# Altium schematic sheet Power.SchDoc
size 420 x 297 mm; SheetNumber: 5; SheetTotal: 34
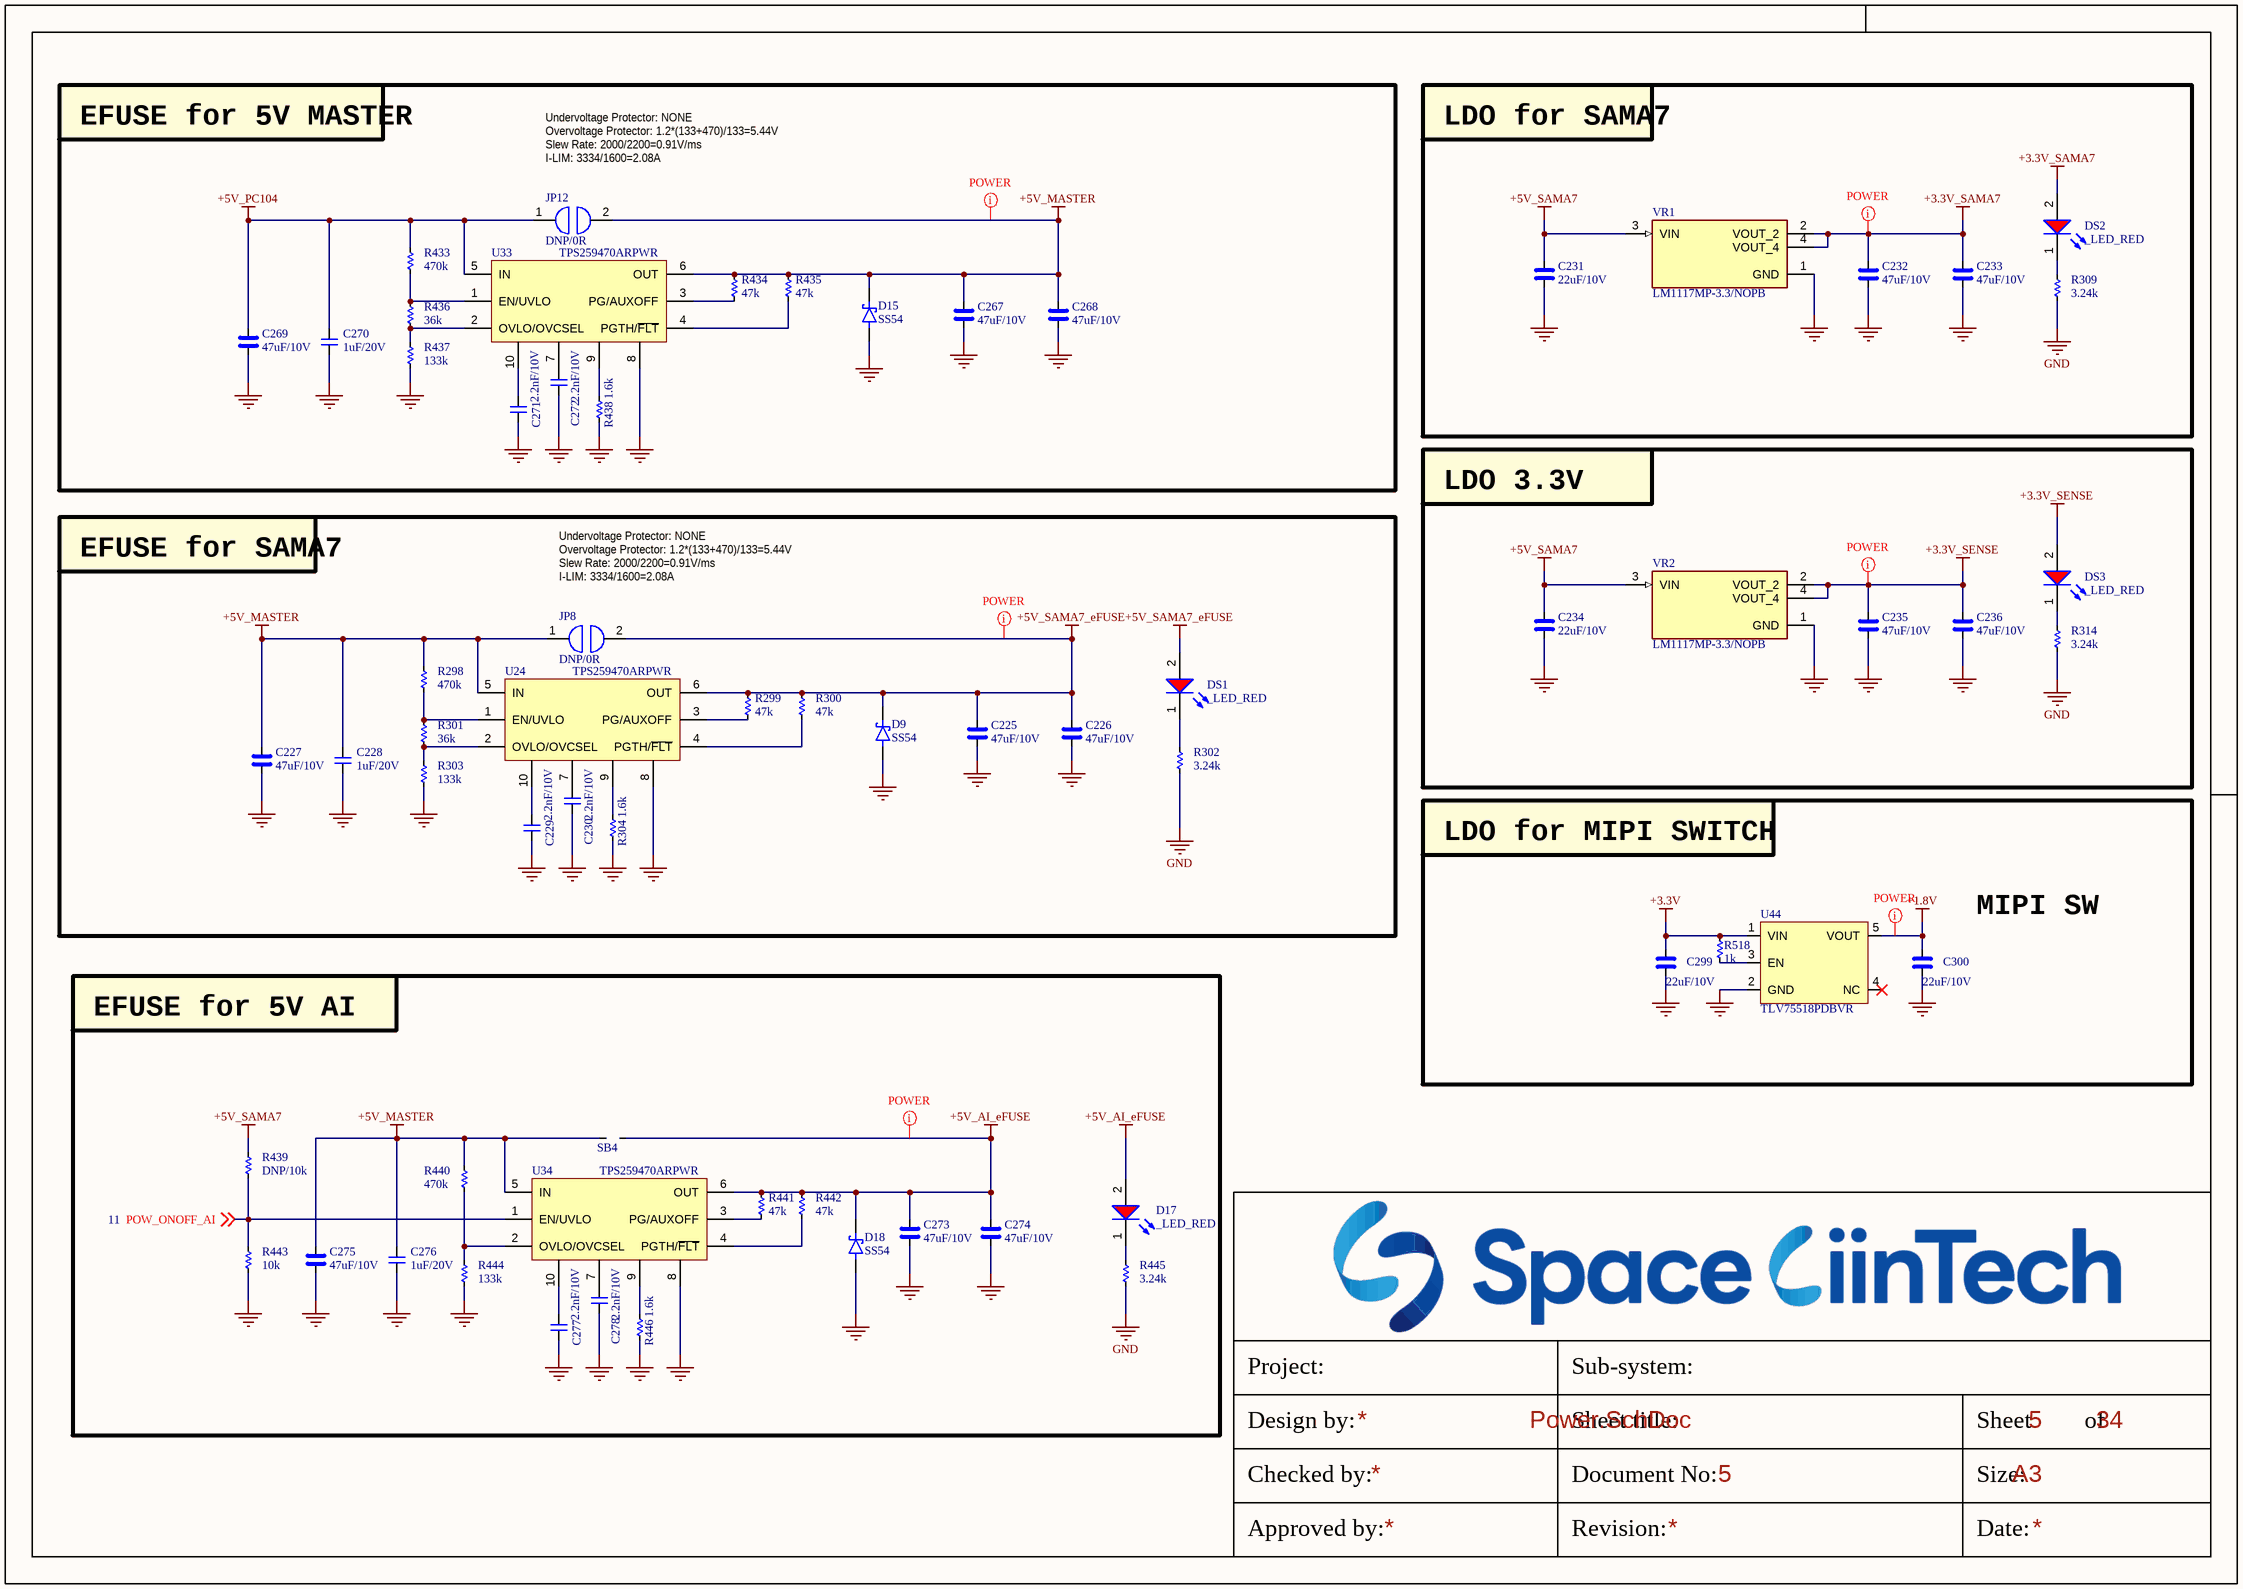
[diagram p0: Power.SchDoc]

## Parts
C225  47uF/10V  [CAP_C_3225X80]
C226  47uF/10V  [CAP_C_3225X80]
C227  47uF/10V  [CAP_C_3225X80]
C228  1uF/20V  [CAP_C_1005X50_L]
C229  2.2nF/10V  [CAP_C_1005X50_L]
C230  2.2nF/10V  [CAP_C_1005X50_L]
C231  22uF/10V  [CAP_C_1608X80]
C232  47uF/10V  [CAP_C_3225X80]
C233  47uF/10V  [CAP_C_3225X80]
C234  22uF/10V  [CAP_C_1608X80]
C235  47uF/10V  [CAP_C_3225X80]
C236  47uF/10V  [CAP_C_3225X80]
C267  47uF/10V  [CAP_C_3225X80]
C268  47uF/10V  [CAP_C_3225X80]
C269  47uF/10V  [CAP_C_3225X80]
C270  1uF/20V  [CAP_C_1005X50_L]
C271  2.2nF/10V  [CAP_C_1005X50_L]
C272  2.2nF/10V  [CAP_C_1005X50_L]
C273  47uF/10V  [CAP_C_3225X80]
C274  47uF/10V  [CAP_C_3225X80]
C275  47uF/10V  [CAP_C_3225X80]
C276  1uF/20V  [CAP_C_1005X50_L]
C277  2.2nF/10V  [CAP_C_1005X50_L]
C278  2.2nF/10V  [CAP_C_1005X50_L]
C299  22uF/10V  [CAP_C_1608X80]
C300  22uF/10V  [CAP_C_1608X80]
D9  SS54  [DO-214AC_SMA]
D15  SS54  [DO-214AC_SMA]
D17  _LED_RED  [LED_0603]
D18  SS54  [DO-214AC_SMA]
DS1  _LED_RED  [LED_0603]
DS2  _LED_RED  [LED_0603]
DS3  _LED_RED  [LED_0603]
JP8  DNP/0R  [JUMPER_1608]
JP12  DNP/0R  [JUMPER_1608]
R298  470k  [RES_C_1005x30_L]
R299  47k  [RES_C_1005x30_L]
R300  47k  [RES_C_1005x30_L]
R301  36k  [RES_C_1005x30_L]
R302  3.24k  [RES_C_1005x30_L]
R303  133k  [RES_C_1005x30_L]
R304  1.6k  [RES_C_1005x30_L]
R309  3.24k  [RES_C_1005x30_L]
R314  3.24k  [RES_C_1005x30_L]
R433  470k  [RES_C_1005x30_L]
R434  47k  [RES_C_1005x30_L]
R435  47k  [RES_C_1005x30_L]
R436  36k  [RES_C_1005x30_L]
R437  133k  [RES_C_1005x30_L]
R438  1.6k  [RES_C_1005x30_L]
R439  DNP/10k  [RES_C_1005x30_L]
R440  470k  [RES_C_1005x30_L]
R441  47k  [RES_C_1005x30_L]
R442  47k  [RES_C_1005x30_L]
R443  10k  [RES_C_1005x30_L]
R444  133k  [RES_C_1005x30_L]
R445  3.24k  [RES_C_1005x30_L]
R446  1.6k  [RES_C_1005x30_L]
R518  1k  [RES_C_1005x30_L]
SB4  JUMPER  [JUMPER_1608]  (value not drawn)
U24  TPS259470ARPWR  [VQFN-HR-10]
U33  TPS259470ARPWR  [VQFN-HR-10]
U34  TPS259470ARPWR  [VQFN-HR-10]
U44  TLV75518PDBVR  [SOT25]
VR1  LM1117MP-3.3/NOPB  [VREG_LM1117MP-3.3/NOPB]
VR2  LM1117MP-3.3/NOPB  [VREG_LM1117MP-3.3/NOPB]

## Blocks framed on the sheet
EFUSE for 5V MASTER: C267-C272 D15 JP12 R433-R438 U33
LDO for SAMA7: C231-C233 DS2 R309 VR1
LDO 3.3V: C234-C236 DS3 R314 VR2
EFUSE for SAMA7: C225-C230 D9 DS1 JP8 R298-R304 U24
EFUSE for 5V AI: C273-C278 D17 D18 R439-R446 SB4 U34

## Nets
+1.8V: C300.1 U44.5(VOUT)
+3.3V: C299.1 R518.2 U44.1(VIN)
+3.3V_SAMA7: C232.2 C233.2 DS2.2(A) VR1.2(VOUT_2) VR1.4(VOUT_4)
+3.3V_SENSE: C235.2 C236.2 DS3.2(A) VR2.2(VOUT_2) VR2.4(VOUT_4)
+5V_AI_eFUSE: C273.2 C274.2 D17.2(A) D18.1(K) R441.2 R442.2 SB4.2 U34.6(OUT)
+5V_MASTER: C227.2 C228.2 C267.2 C268.2 C275.2 C276.2 D15.1(K) JP8.1 JP12.2 R298.2 R434.2 R435.2 R440.2 SB4.1 U24.5(IN) U33.6(OUT) U34.5(IN)
+5V_PC104: C269.2 C270.2 JP12.1 R433.2 U33.5(IN)
+5V_SAMA7: C231.1 C234.1 R439.1 VR1.3(VIN) VR2.3(VIN)
+5V_SAMA7_eFUSE: C225.2 C226.2 D9.1(K) DS1.2(A) JP8.2 R299.2 R300.2 U24.6(OUT)
GND: C225.1 C226.1 C227.1 C228.1 C229.1 C230.1 C231.2 C232.1 C233.1 C234.2 C235.1 C236.1 C267.1 C268.1 C269.1 C270.1 C271.1 C272.1 C273.1 C274.1 C275.1 C276.1 C277.1 C278.1 C299.2 C300.2 D9.2(A) D15.2(A) D18.2(A) R302.1 R303.1 R304.1 R309.1 R314.1 R437.1 R438.1 R443.2 R444.1 R445.1 R446.1 U24.8 U33.8 U34.8 U44.2(GND) VR1.1(GND) VR2.1(GND)
POW_ONOFF_AI: R439.2 R443.1 U34.1(EN/UVLO) ; off-sheet POW_ONOFF_AI
NetC229_2: C229.2 U24.10
NetC230_2: C230.2 U24.7
NetC271_2: C271.2 U33.10
NetC272_2: C272.2 U33.7
NetC277_2: C277.2 U34.10
NetC278_2: C278.2 U34.7
NetD17_1: D17.1(K) R445.2
NetDS1_1: DS1.1(K) R302.2
NetDS2_1: DS2.1(K) R309.2
NetDS3_1: DS3.1(K) R314.2
NetR298_1: R298.1 R301.2 U24.1(EN/UVLO)
NetR299_1: R299.1 U24.3(PG/AUXOFF)
NetR300_1: R300.1 U24.4(PGTH/~{FLT})
NetR301_1: R301.1 R303.2 U24.2(OVLO/OVCSEL)
NetR304_2: R304.2 U24.9
NetR433_1: R433.1 R436.2 U33.1(EN/UVLO)
NetR434_1: R434.1 U33.3(PG/AUXOFF)
NetR435_1: R435.1 U33.4(PGTH/~{FLT})
NetR436_1: R436.1 R437.2 U33.2(OVLO/OVCSEL)
NetR438_2: R438.2 U33.9
NetR440_1: R440.1 R444.2 U34.2(OVLO/OVCSEL)
NetR441_1: R441.1 U34.3(PG/AUXOFF)
NetR442_1: R442.1 U34.4(PGTH/~{FLT})
NetR446_2: R446.2 U34.9
NetR518_1: R518.1 U44.3(EN)

Not connected (* = marked no-connect by the designer): U44 4(NC)*

## Layout directives
net class POWER: +1.8V, +3.3V_SAMA7, +3.3V_SENSE, +5V_AI_eFUSE, +5V_MASTER, +5V_SAMA7_eFUSE

## Notes on the sheet
- Undervoltage Protector: NONE
- Overvoltage Protector: 1.2*(133+470)/133=5.44V
- Slew Rate: 2000/2200=0.91V/ms
- I-LIM: 3334/1600=2.08A
- LDO for MIPI SWITCH
- MIPI SW
- Project:
- Sub-system:
- Design by:
- Sheet title:
- Sheet
- of
- Checked by:
- Approved by:
- Revision:
- Document No:
- Size:
- Date:
- A3

## Library data of the parts
C225-C227 C231-C236 C267-C269 = _CAP_C_High_2: CAP High Value
C228-C230 C270-C272 = _CAP_C_2: CAP
C273-C275 C299 C300 = _CAP_C_High_2: CAP CHIP High Value
C276-C278 = _CAP_C_2: CAP CHIP
D9 D15 D18 = DIODE SCHOTTKY
D17 = LED_RED: LED RED CLEAR 0603 SMD
JP8 JP12 = JUMPER
R298-R304 R309 R314 R433-R446 R518 = _RES_B_2: RES
U44 = IC_POWER_AP7347DQ
VR1 VR2 = LM1117MP-3.3/NOPB: 800-mA 15-V linear voltage regulator; MF: Texas Instruments; SnapEDA_Link: https://www.snapeda.com/parts/LM1117MP-3.3/NOPB/Texas+Instruments/view-part/?ref=snap; Package: SOT-223-4 Texas Instruments; Value: *; MP: LM1117MP-3.3/NOPB; Check_prices: https://www.snapeda.com/parts/LM1117MP-3.3/NOPB/Texas+Instruments/view-part/?ref=eda